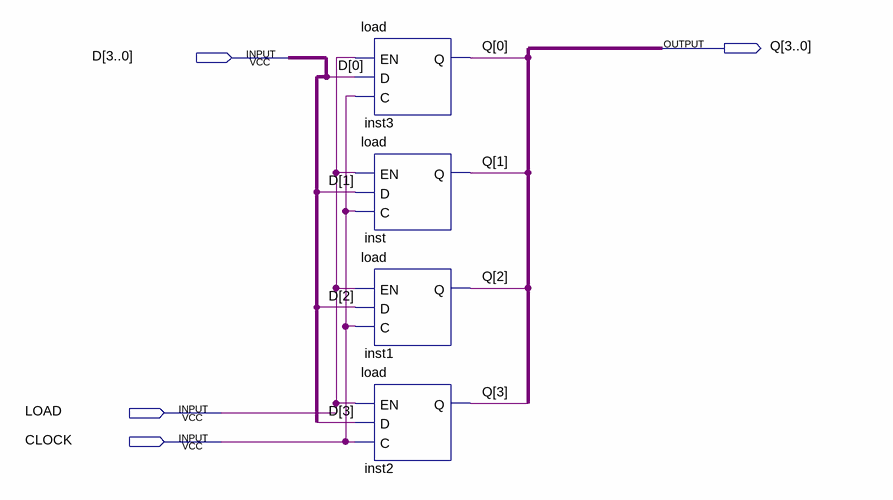
[diagram p0: schematic sheet]
// Quartus schematic jicun.bdf as structural Verilog: 4 symbols, 4 pins
module jicun (
  input  [3:0] D,
  input  LOAD,
  input  CLOCK,
  output [3:0] Q
);

  load inst3 (.EN(LOAD), .D(D[0]), .C(CLOCK), .Q(Q[0]));
  load inst (.EN(LOAD), .D(D[1]), .C(CLOCK), .Q(Q[1]));
  load inst1 (.EN(LOAD), .D(D[2]), .C(CLOCK), .Q(Q[2]));
  load inst2 (.EN(LOAD), .D(D[3]), .C(CLOCK), .Q(Q[3]));
endmodule
